# EAGLE schematic ChromDot_Ring (EAGLE 9.1.0)
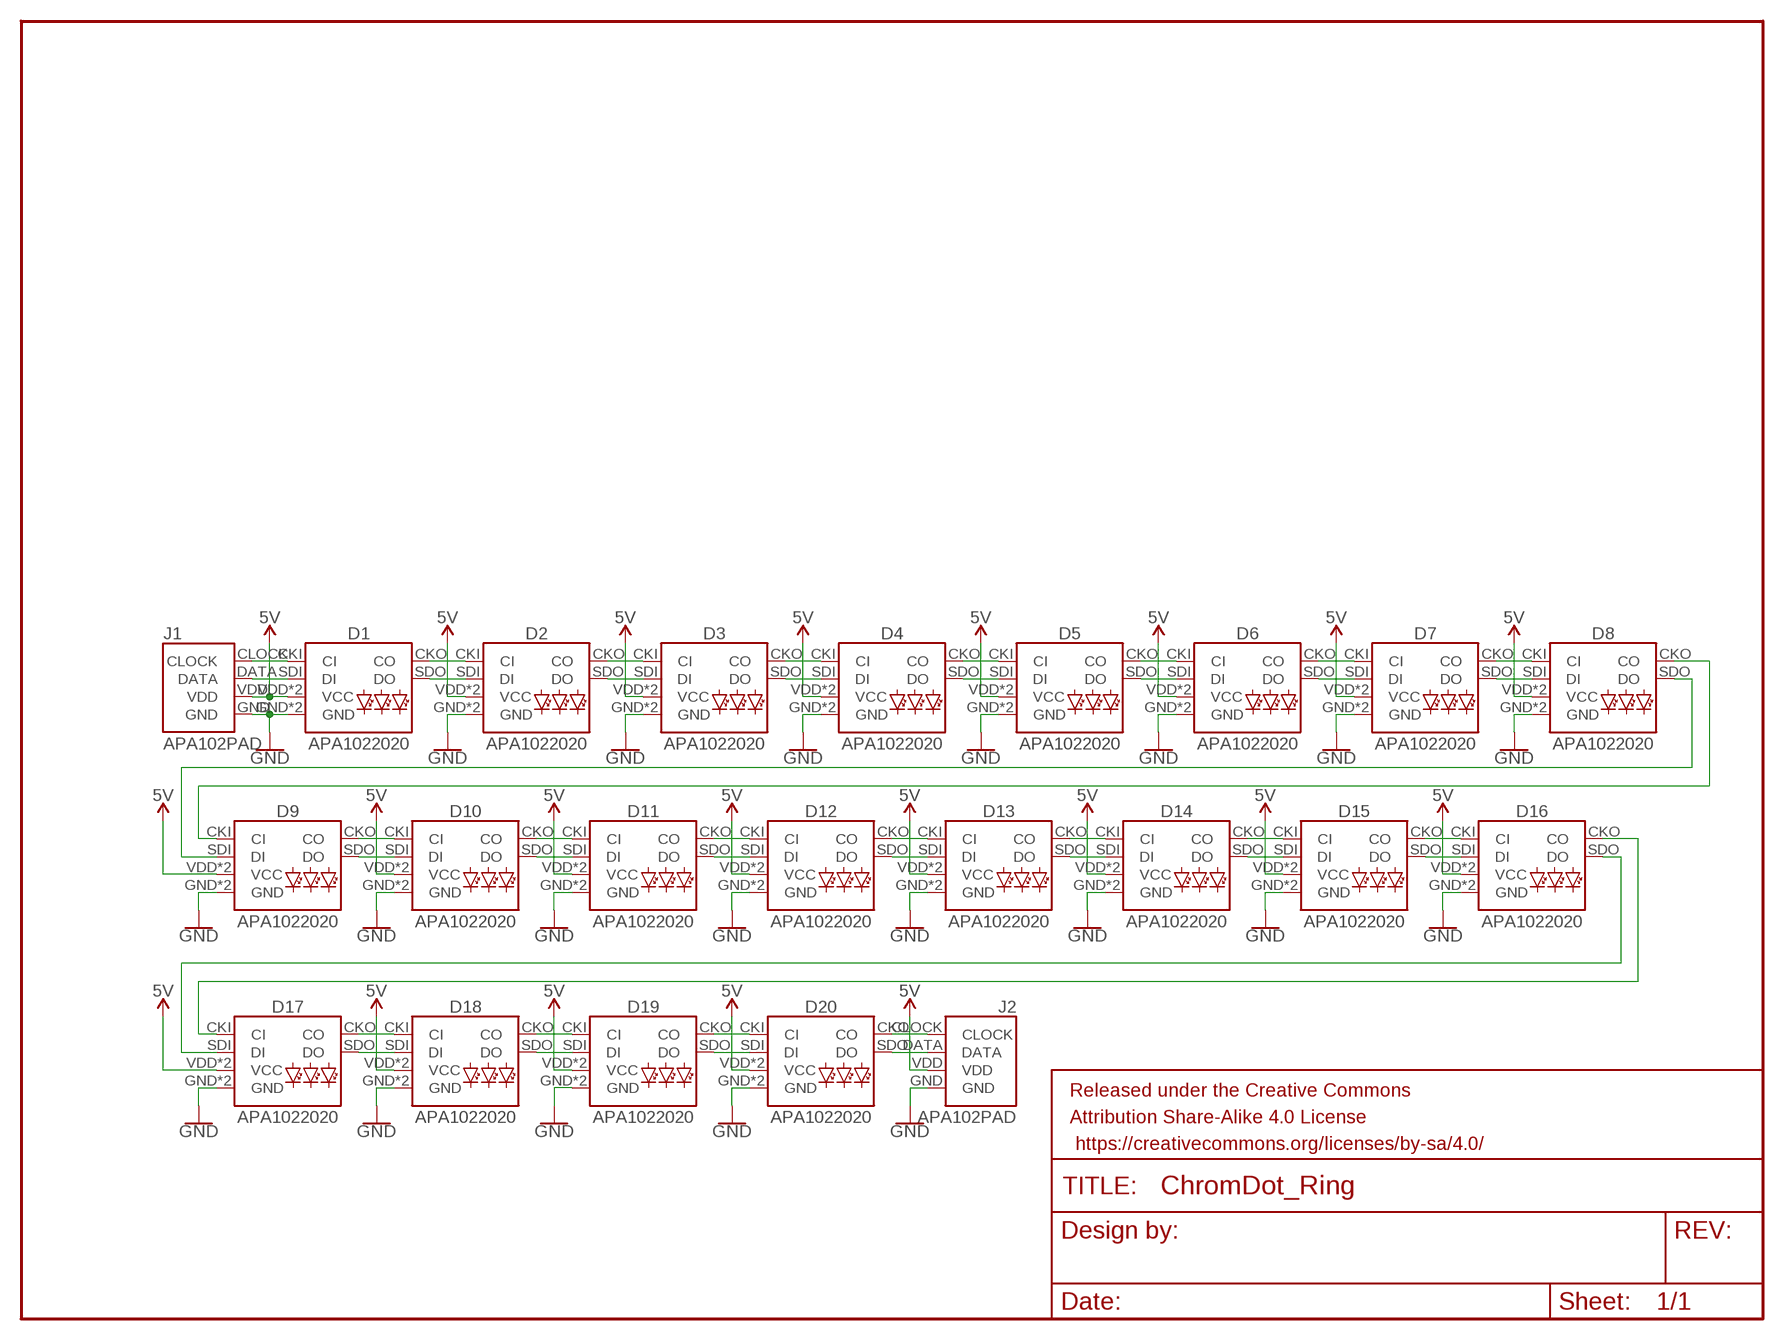
[diagram p0: schematic, sheet 1]

## Parts
D1  APA1022020  [APA102-2020]
D2  APA1022020  [APA102-2020]
D3  APA1022020  [APA102-2020]
D4  APA1022020  [APA102-2020]
D5  APA1022020  [APA102-2020]
D6  APA1022020  [APA102-2020]
D7  APA1022020  [APA102-2020]
D8  APA1022020  [APA102-2020]
D9  APA1022020  [APA102-2020]
D10  APA1022020  [APA102-2020]
D11  APA1022020  [APA102-2020]
D12  APA1022020  [APA102-2020]
D13  APA1022020  [APA102-2020]
D14  APA1022020  [APA102-2020]
D15  APA1022020  [APA102-2020]
D16  APA1022020  [APA102-2020]
D17  APA1022020  [APA102-2020]
D18  APA1022020  [APA102-2020]
D19  APA1022020  [APA102-2020]
D20  APA1022020  [APA102-2020]
FRAME1  FRAME-LETTER  [CREATIVE_COMMONS]
J1  APA102PAD  [APA102PADS]
J2  APA102PAD  [APA102PADS]

## Nets
5V: D1.VDD(VCC) D1.VDDPAD(VCC) D2.VDD(VCC) D2.VDDPAD(VCC) D3.VDD(VCC) D3.VDDPAD(VCC) D4.VDD(VCC) D4.VDDPAD(VCC) D5.VDD(VCC) D5.VDDPAD(VCC) D6.VDD(VCC) D6.VDDPAD(VCC) D7.VDD(VCC) D7.VDDPAD(VCC) D8.VDD(VCC) D8.VDDPAD(VCC) D9.VDD(VCC) D9.VDDPAD(VCC) D10.VDD(VCC) D10.VDDPAD(VCC) D11.VDD(VCC) D11.VDDPAD(VCC) D12.VDD(VCC) D12.VDDPAD(VCC) D13.VDD(VCC) D13.VDDPAD(VCC) D14.VDD(VCC) D14.VDDPAD(VCC) D15.VDD(VCC) D15.VDDPAD(VCC) D16.VDD(VCC) D16.VDDPAD(VCC) D17.VDD(VCC) D17.VDDPAD(VCC) D18.VDD(VCC) D18.VDDPAD(VCC) D19.VDD(VCC) D19.VDDPAD(VCC) D20.VDD(VCC) D20.VDDPAD(VCC) J1.VDD J2.VDD
GND: D1.GND D1.GNDPAD(GND) D2.GND D2.GNDPAD(GND) D3.GND D3.GNDPAD(GND) D4.GND D4.GNDPAD(GND) D5.GND D5.GNDPAD(GND) D6.GND D6.GNDPAD(GND) D7.GND D7.GNDPAD(GND) D8.GND D8.GNDPAD(GND) D9.GND D9.GNDPAD(GND) D10.GND D10.GNDPAD(GND) D11.GND D11.GNDPAD(GND) D12.GND D12.GNDPAD(GND) D13.GND D13.GNDPAD(GND) D14.GND D14.GNDPAD(GND) D15.GND D15.GNDPAD(GND) D16.GND D16.GNDPAD(GND) D17.GND D17.GNDPAD(GND) D18.GND D18.GNDPAD(GND) D19.GND D19.GNDPAD(GND) D20.GND D20.GNDPAD(GND) J1.GND J2.GND
N$1: D4.CKO(CO) D5.CKI(CI)
N$2: D1.CKI(CI) J1.CLOCK
N$3: D1.SDI(DI) J1.DATA
N$4: D1.CKO(CO) D2.CKI(CI)
N$5: D1.SDO(DO) D2.SDI(DI)
N$6: D2.CKO(CO) D3.CKI(CI)
N$7: D2.SDO(DO) D3.SDI(DI)
N$8: D3.CKO(CO) D4.CKI(CI)
N$9: D3.SDO(DO) D4.SDI(DI)
N$10: D4.SDO(DO) D5.SDI(DI)
N$11: D5.CKO(CO) D6.CKI(CI)
N$12: D5.SDO(DO) D6.SDI(DI)
N$13: D6.CKO(CO) D7.CKI(CI)
N$14: D6.SDO(DO) D7.SDI(DI)
N$15: D7.CKO(CO) D8.CKI(CI)
N$16: D7.SDO(DO) D8.SDI(DI)
N$17: D8.CKO(CO) D9.CKI(CI)
N$18: D8.SDO(DO) D9.SDI(DI)
N$19: D9.CKO(CO) D10.CKI(CI)
N$20: D9.SDO(DO) D10.SDI(DI)
N$21: D10.CKO(CO) D11.CKI(CI)
N$22: D10.SDO(DO) D11.SDI(DI)
N$23: D11.CKO(CO) D12.CKI(CI)
N$24: D11.SDO(DO) D12.SDI(DI)
N$25: D12.CKO(CO) D13.CKI(CI)
N$26: D12.SDO(DO) D13.SDI(DI)
N$27: D13.CKO(CO) D14.CKI(CI)
N$28: D13.SDO(DO) D14.SDI(DI)
N$29: D14.CKO(CO) D15.CKI(CI)
N$30: D14.SDO(DO) D15.SDI(DI)
N$31: D15.CKO(CO) D16.CKI(CI)
N$32: D15.SDO(DO) D16.SDI(DI)
N$33: D16.CKO(CO) D17.CKI(CI)
N$34: D16.SDO(DO) D17.SDI(DI)
N$35: D17.CKO(CO) D18.CKI(CI)
N$36: D17.SDO(DO) D18.SDI(DI)
N$37: D18.CKO(CO) D19.CKI(CI)
N$38: D18.SDO(DO) D19.SDI(DI)
N$39: D19.CKO(CO) D20.CKI(CI)
N$40: D19.SDO(DO) D20.SDI(DI)
N$41: D20.CKO(CO) J2.CLOCK
N$42: D20.SDO(DO) J2.DATA

## Library data of the parts
D1-D20 = SparkFun-LED:APA102: APA102 Addressable RGB LED Used in manufacturing of various products at SparkFun Packages: 5050 2020 SparkFun Products: SparkFun Lumenati Boards <https://www.sparkfun.com/categories/405>; PROD_ID: DIO-13883
FRAME1 = SparkFun-Aesthetics:FRAME-LETTER: Schematic Frame - Letter Standard 8.5x11 US Letter frame
J1 J2 = Andy:APA102PAD